# Altium project PROC154E3_SCH.PrjPcb (part 46 of 60)
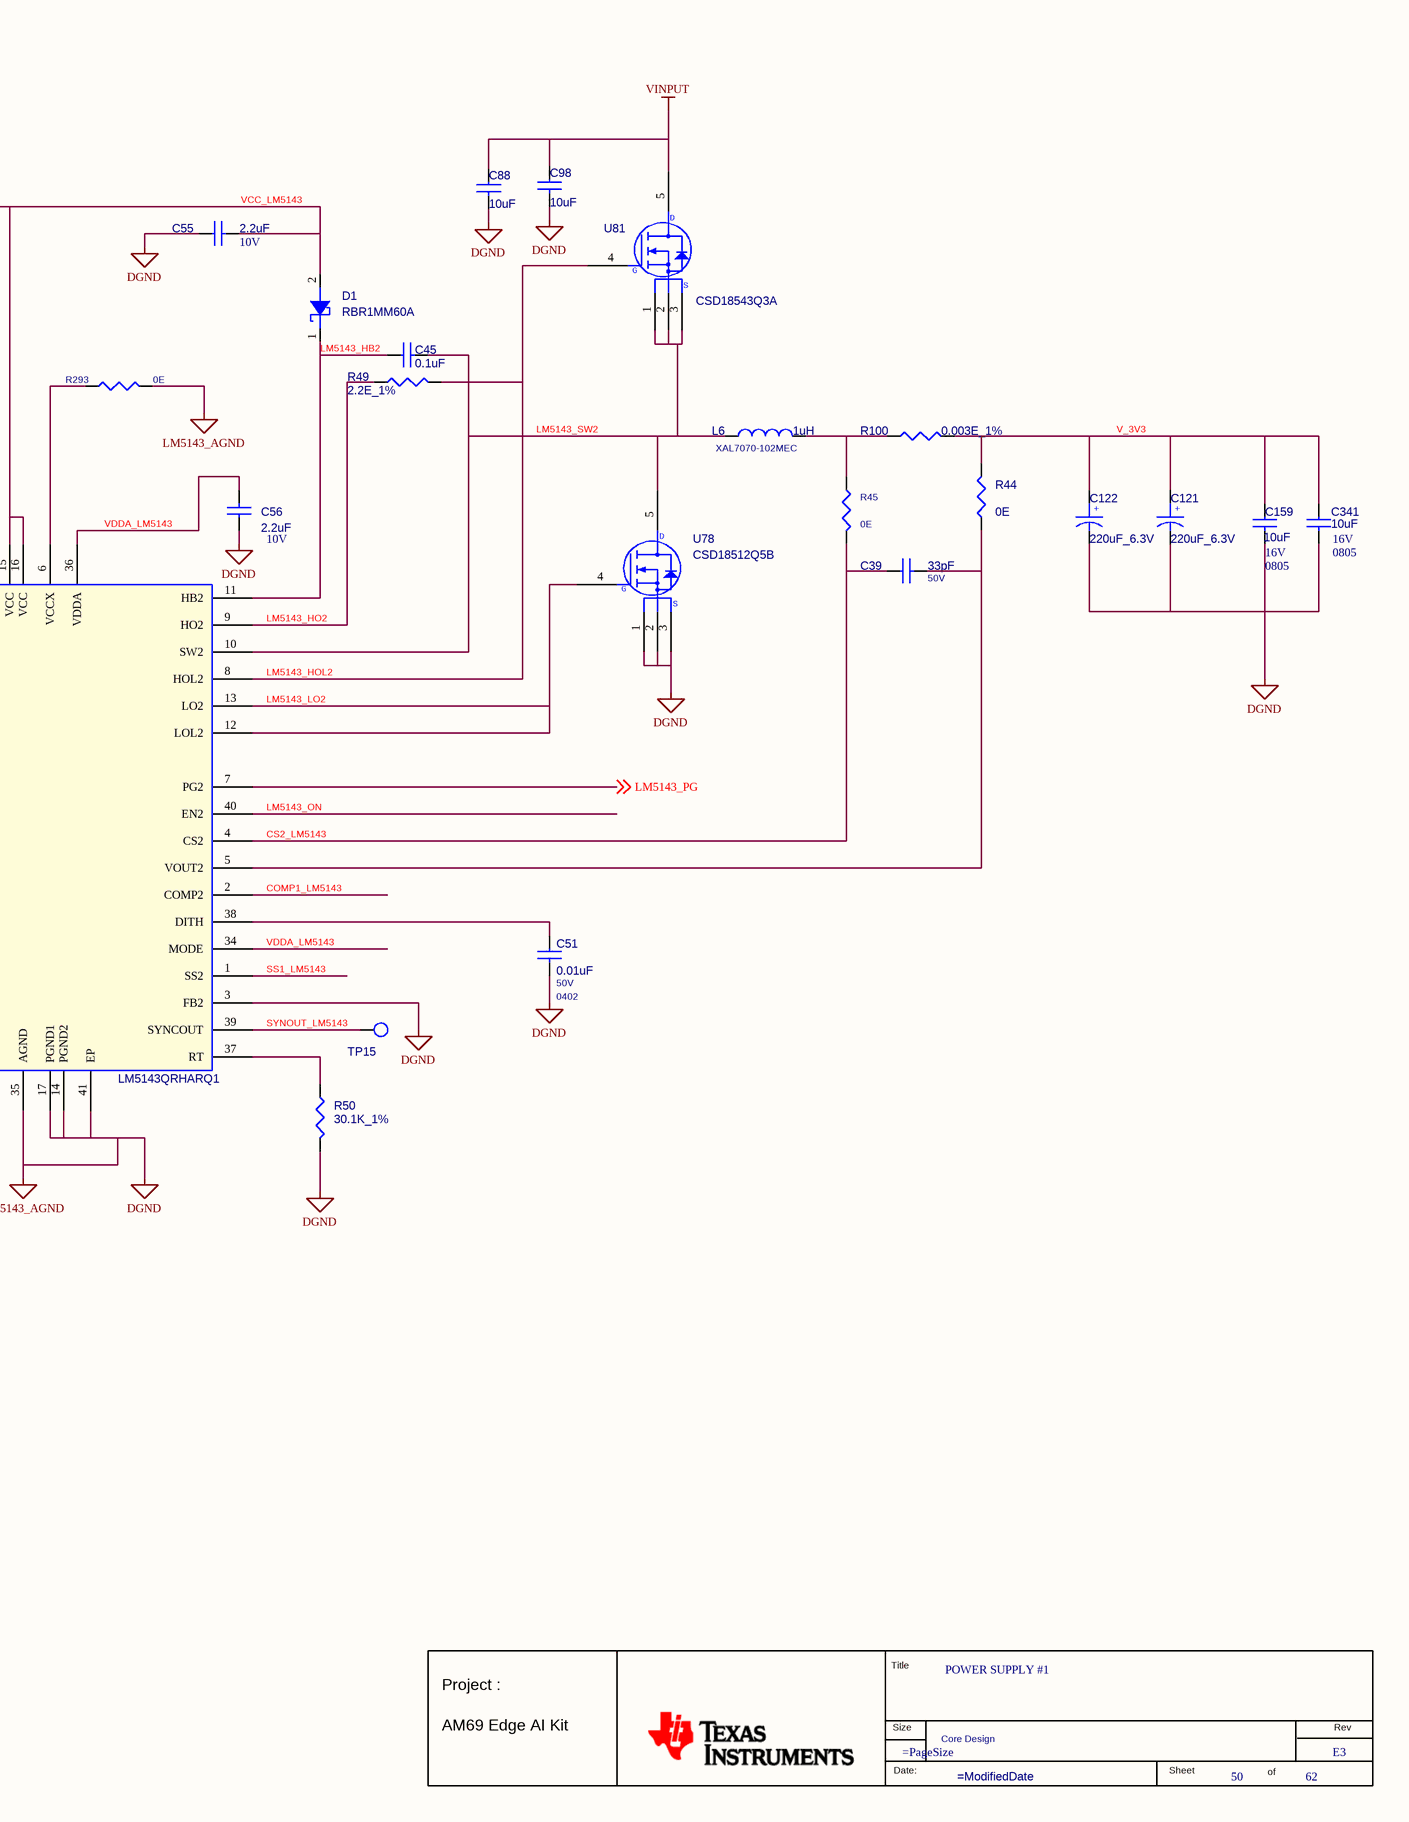
[diagram p184: 50. POWER SUPPLY #1.SchDoc, right]

## Sheet 50. POWER SUPPLY #1.SchDoc: POWER SUPPLY #1 (continued)

### Parts
(Parts that share a designator on the sheet are numbered #1, #2 ... from top to bottom, then left to right.)
*#50  RevCode: E3  Title: POWER SUPPLY #1  Page Number: 50  Page Count: 62  Variant Name: Core Design  (hidden comment: MISTRAL_TITLEBLK_CSIZE_1)  (graphical)
C36  1000pF  [CAP0402_0-75]
C39  33pF  Voltage: 50V  [CAP0402_0-75]
C42  68pF  [CAP0402_0-75]
C45  0.1uF  [CAP0402_0-75]
C51  0.01uF  Voltage: 50V  Package: 0402  [CAP0402_0-75]
C55  2.2uF  Voltage: 10V  [CAP0603_1]
C56  2.2uF  Voltage: 10V  [CAP0603_1]
C57  220uF_6.3V  [CAPT7343V_2]
C58  220uF_6.3V  [CAPT7343V_2]
C59  2.2uF  Voltage: 10V  [CAP0603_1]
C60  1uF  Voltage: 10V  [CAP0402_0-75]
C62  33pF  Voltage: 50V  [CAP0402_0-75]
C63  0.1uF  Voltage: 50V  [CAP0402_0-75]
C64  0.1uF  [CAP0402_0-75]
C75  10uF  [CAP2220_2-5]
C76  10uF  [CAP2220_2-5]
C88  10uF  [CAP2220_2-5]
C98  10uF  [CAP2220_2-5]
C121  220uF_6.3V  [CAPT7343V_2]
C122  220uF_6.3V  [CAPT7343V_2]
C158  10uF  Package: 0805  Voltage: 16V  [CAP0805_1-5]
C159  10uF  Package: 0805  Voltage: 16V  [CAP0805_1-5]
C341  10uF  Package: 0805  Voltage: 16V  [CAP0805_1-5]
C342  10uF  Voltage: 16V  Package: 0805  [CAP0805_1-5]
D1  RBR1MM60A  [DIO_SOD123F_0-9]
D2  RBR1MM60A  [DIO_SOD123F_0-9]
L1  1uH  Mfr_part_number: XAL7070-102MEC  [IND_XAL7070_300X310_SMD_7]
L6  1uH  Mfr_part_number: XAL7070-102MEC  [IND_XAL7070_300X310_SMD_7]
R44  0E  [RES0402_0-5]
R45  0E  [RES0402_0-5]
R47  0.003E_1%  [RES1206_1]
R48  22.6K_1%  [RES0402_0-5]
R49  2.2E_1%  [RES0402_0-5]
R50  30.1K_1%  [RES0402_0-5]
R55  2.2E_1%  [RES0402_0-5]
R69  0E  [RES0402_0-5]
R70  0E  [RES0402_0-5]
R100  0.003E_1%  [RES1206_1]
R293  0E  [RES0402_0-5]
R316  10K  [RES0402_0-5]
R326  0E  [RES0402_0-5]
R327  10K  [RES0402_0-5]
R328  45K_1%  [RES0402_0-5]
TP11  THRU HOLE  [TP_40X65]  (value not drawn)
TP15  TP30_SMD  [TP30_SMD]  (value not drawn)
TP67  THRU HOLE  [TP_40X65]  (value not drawn)
TP84  THRU HOLE  [TP_40X65]  (value not drawn)
U11  LM5143QRHARQ1  [QFN40_19-68_240X240_1_EP3-4]
U75  CSD18543Q3A  [VSONP8_CSD18543Q_120X130_0-9]
U76  CSD18512Q5B  [VSON8_CSD1850_240X200_1-1]
U78  CSD18512Q5B  [VSON8_CSD1850_240X200_1-1]
U81  CSD18543Q3A  [VSONP8_CSD18543Q_120X130_0-9]

### Nets
DGND: C36.2 C42.2 C51.2 C55.1 C56.1 C57.2 C58.2 C59.1 C60.2 C64.2 C75.2 C76.2 C88.2 C98.2 C121.2 C122.2 C158.2 C159.2 C341.2 C342.2 R50.2 R293.2 R327.1 U11.3(FB2) U11.14(PGND2) U11.17(PGND1) U11.35(AGND) U11.41(EP) U76.1(S1) U76.2(S2) U76.3(S3) U78.1(S1) U78.2(S2) U78.3(S3)  [also labelled LM5143_AGND]  [project net VDD_CPU_HCPS_GOSNS]
V_3V3: C57.1 C58.1 C121.1 C122.1 C158.1 C159.1 C341.1 C342.1 R44.2 R47.1 R69.2 R100.2 R316.2 R328.1 TP11.1(TP) TP67.1(TP)  [also labelled VSYS_3V3]
VDD_IO_1V8_REG: TP84.1(TP)
VINPUT: C75.1 C76.1 C88.1 C98.1 U11.25(VIN) U75.5(D1) U81.5(D1)
COMP1_LM5143: C42.1 R48.2 U11.2(COMP2) U11.29(COMP1)
CS1_LM5143: C62.2 R70.2 U11.27(CS1)
CS2_LM5143: C39.1 R45.2 U11.4(CS2)
LM5143_FB: R326.2 R327.2 R328.2 U11.28(FB1)
LM5143_HB1: C63.2 D2.1(CATHODE) U11.20(HB1)
LM5143_HB2: C45.1 D1.1(CATHODE) U11.11(HB2)
LM5143_HO1: R55.2 U11.22(HO1)
LM5143_HO2: R49.1 U11.9(HO2)
LM5143_HOL1: R55.1 U11.23(HOL1) U75.4(GATE)
LM5143_HOL2: R49.2 U11.8(HOL2) U81.4(GATE)
LM5143_LO1: U11.18(LO1) U11.19(LOL1) U76.4(GATE)
LM5143_LO2: U11.12(LOL2) U11.13(LO2) U78.4(GATE)
LM5143_ON: U11.31(EN1) U11.40(EN2) ; off-sheet LM5143_EN  [also labelled LM5143_EN]
LM5143_PG: R316.1 U11.7(PG2) U11.24(PG1) ; off-sheet LM5143_PG
LM5143_SW1: C63.1 L1.2 U11.21(SW1) U75.1(S1) U75.2(S2) U75.3(S3) U76.5(D1)
LM5143_SW2: C45.2 L6.1 U11.10(SW2) U78.5(D1) U81.1(S1) U81.2(S2) U81.3(S3)
RES_LM5143: C60.1 U11.32(RES)
SS1_LM5143: C64.1 U11.1(SS2) U11.30(SS1)
SYNOUT_LM5143: TP15.1(TP) U11.39(SYNCOUT)
VCC_LM5143: C55.2 C59.2 D1.2(ANODE) D2.2(ANODE) U11.15(VCC) U11.16(VCC)
VDDA_LM5143: C56.2 R326.1 U11.33(DEMB) U11.34(MODE) U11.36(VDDA)
NetC36_1: C36.1 R48.1
NetC39_2: C39.2 R44.1 U11.5(VOUT2)
NetC51_1: C51.1 U11.38(DITH)
NetC62_1: C62.1 R69.1 U11.26(VOUT1)
NetL1_1: L1.1 R47.2 R70.1
NetL6_2: L6.2 R45.1 R100.1
NetR50_1: R50.1 U11.37(RT)
NetR293_1: R293.1 U11.6(VCCX)

### Notes on the sheet
- TI WEBENCH Simulation Inputs:
  Vin (min) = 15V Vin (max) = 25V
  Vout = 3.3V@30A
  Ta = 25 deg
- POWER SUPPLY #1
- (in symbol CAP_POL) +
- (in symbol MISTRAL_TITLEBLK_CSIZE_1) Title; Project :; Size; Rev; AM69 Edge AI Kit; Date:; Sheet; of
- (in symbol MOSFET_CSD18501Q5A) D; G; S